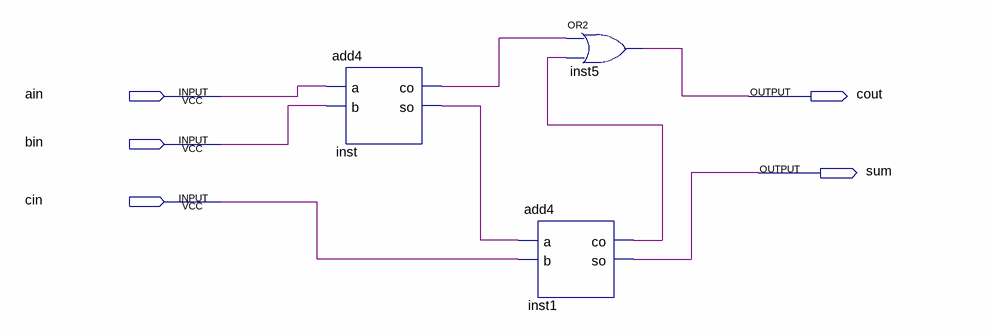
[diagram p0: schematic sheet]
// Quartus schematic Block2.bdf as structural Verilog: 3 symbols, 5 pins
module Block2 (
  input  ain,
  input  bin,
  input  cin,
  output cout,
  output sum
);

  wire inst1_co, inst_co, inst_so;

  add4 inst (.a(ain), .b(bin), .co(inst_co), .so(inst_so));
  or inst5 (cout, inst_co, inst1_co);
  add4 inst1 (.a(inst_so), .b(cin), .co(inst1_co), .so(sum));
endmodule
